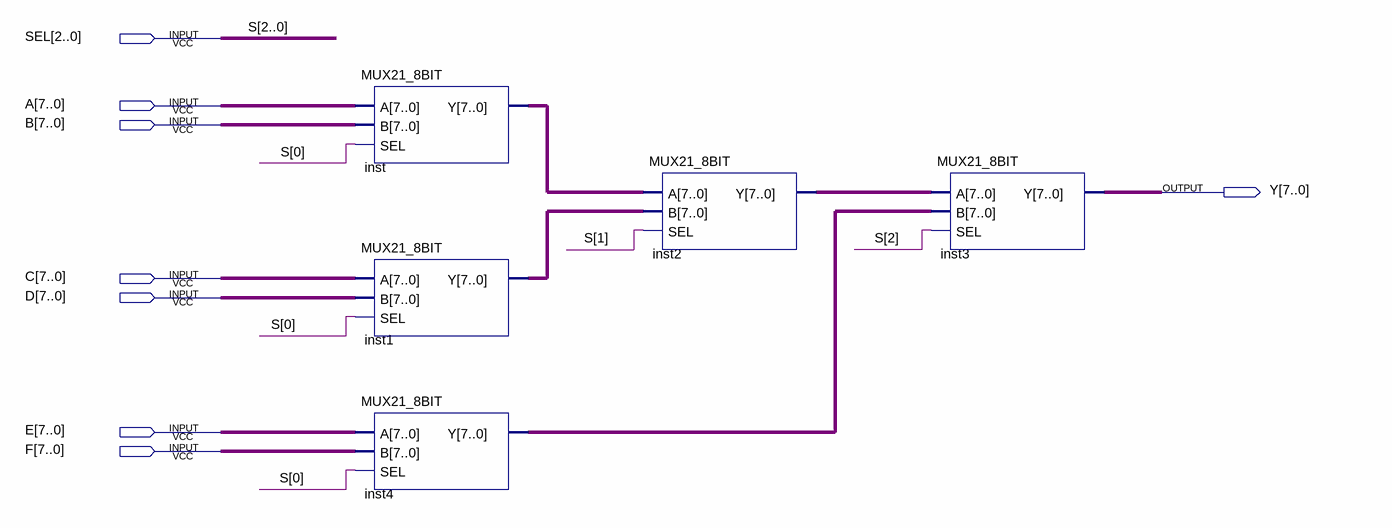
[diagram p0: schematic sheet]
// Quartus schematic MUX61_8BIT.bdf as structural Verilog: 5 symbols, 8 pins
module MUX61_8BIT (
  input  [2:0] SEL,
  input  [7:0] A,
  input  [7:0] B,
  input  [7:0] C,
  input  [7:0] D,
  input  [7:0] E,
  input  [7:0] F,
  output [7:0] Y
);

  wire [7:0] inst1_y, inst2_y, inst4_y, inst_y;

  MUX21_8BIT inst (.A(A), .B(B), .SEL(SEL[0]), .Y(inst_y));
  MUX21_8BIT inst1 (.A(C), .B(D), .SEL(SEL[0]), .Y(inst1_y));
  MUX21_8BIT inst4 (.A(E), .B(F), .SEL(SEL[0]), .Y(inst4_y));
  MUX21_8BIT inst2 (.A(inst_y), .B(inst1_y), .SEL(SEL[1]), .Y(inst2_y));
  MUX21_8BIT inst3 (.A(inst2_y), .B(inst4_y), .SEL(SEL[2]), .Y(Y));

  // Other names for the same wires on the sheet: S[2:0] = SEL
endmodule
